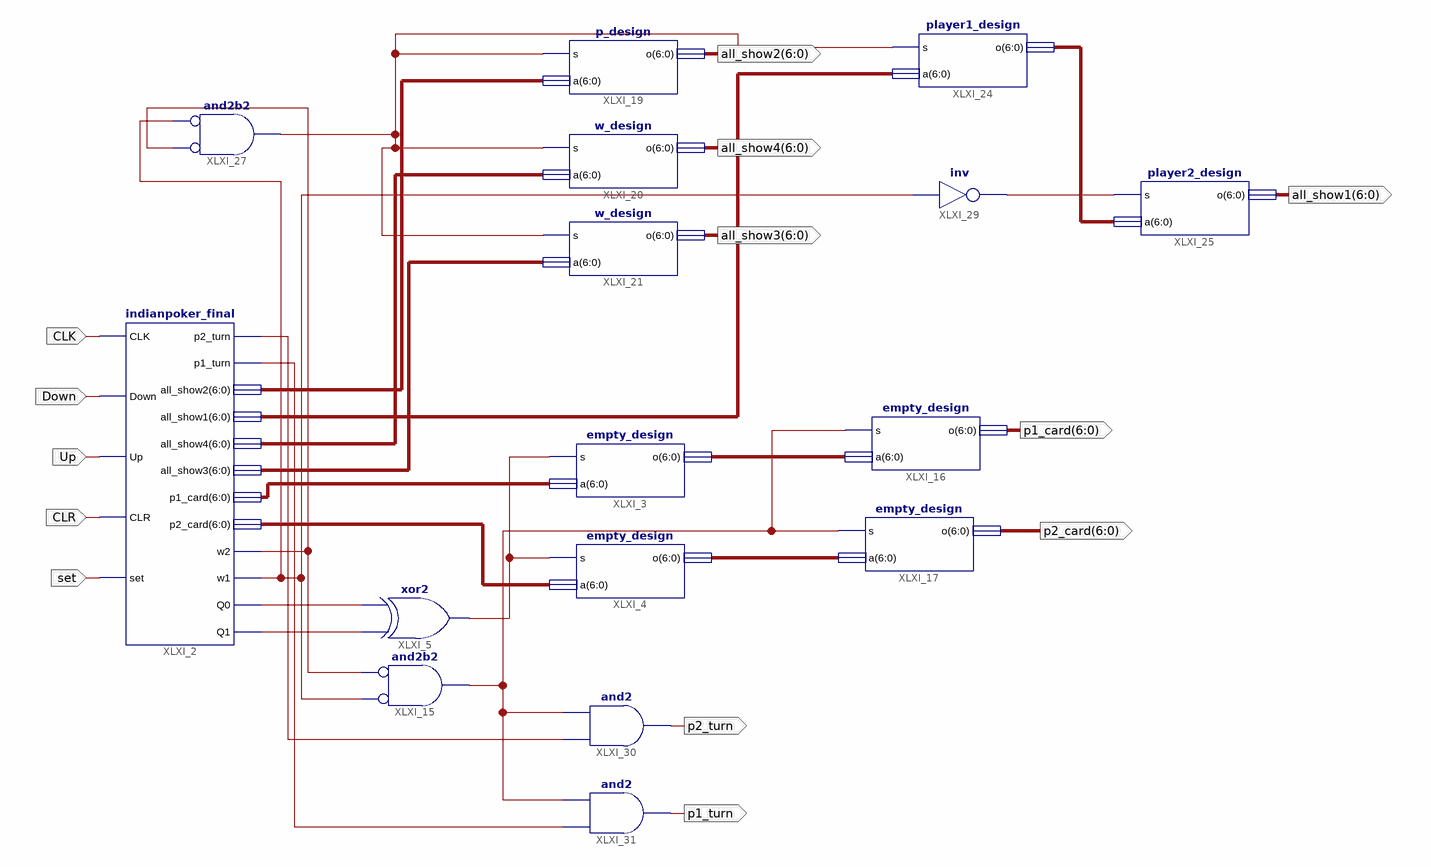
[diagram p0: schematic sheet 1]
// Xilinx ISE schematic indianpoker_final2.sch (spartan3) as structural Verilog: 16 symbols, 13 ports
module indianpoker_final2 (
  input  set,
  input  CLR,
  input  Up,
  input  Down,
  input  CLK,
  output [6:0] p1_card,
  output [6:0] p2_card,
  output [6:0] all_show2,
  output [6:0] all_show4,
  output [6:0] all_show3,
  output [6:0] all_show1,
  output p2_turn,
  output p1_turn
);

  wire XLXN_3, XLXN_4, XLXN_8, XLXN_34, XLXN_45, XLXN_46, XLXN_48, XLXN_49, XLXN_52, XLXN_53;
  wire [6:0] XLXN_1, XLXN_2, XLXN_26, XLXN_27, XLXN_37, XLXN_39, XLXN_40, XLXN_42, XLXN_43;

  indianpoker_final XLXI_2 (
    .CLK(CLK), .Down(Down), .Up(Up), .CLR(CLR), .set(set), .p2_turn(XLXN_53), .p1_turn(XLXN_52),
    .all_show2(XLXN_37), .all_show1(XLXN_42), .all_show4(XLXN_40), .all_show3(XLXN_39), .p1_card(XLXN_2),
    .p2_card(XLXN_1), .w2(XLXN_45), .w1(XLXN_48), .Q0(XLXN_4), .Q1(XLXN_3));
  empty_design XLXI_4 (.s(XLXN_8), .a(XLXN_1), .o(XLXN_27));
  empty_design XLXI_3 (.s(XLXN_8), .a(XLXN_2), .o(XLXN_26));
  xor XLXI_5 (XLXN_8, XLXN_3, XLXN_4);
  and XLXI_15 (XLXN_34, ~XLXN_48, ~XLXN_45);  // and2b2
  empty_design XLXI_16 (.s(XLXN_34), .a(XLXN_26), .o(p1_card));
  empty_design XLXI_17 (.s(XLXN_34), .a(XLXN_27), .o(p2_card));
  p_design XLXI_19 (.s(XLXN_46), .a(XLXN_37), .o(all_show2));
  w_design XLXI_20 (.s(XLXN_46), .a(XLXN_40), .o(all_show4));
  w_design XLXI_21 (.s(XLXN_46), .a(XLXN_39), .o(all_show3));
  player1_design XLXI_24 (.s(XLXN_46), .a(XLXN_42), .o(XLXN_43));
  and XLXI_27 (XLXN_46, ~XLXN_45, ~XLXN_48);  // and2b2
  player2_design XLXI_25 (.s(XLXN_49), .a(XLXN_43), .o(all_show1));
  not XLXI_29 (XLXN_49, XLXN_48);
  and XLXI_30 (p2_turn, XLXN_53, XLXN_34);
  and XLXI_31 (p1_turn, XLXN_52, XLXN_34);
endmodule
